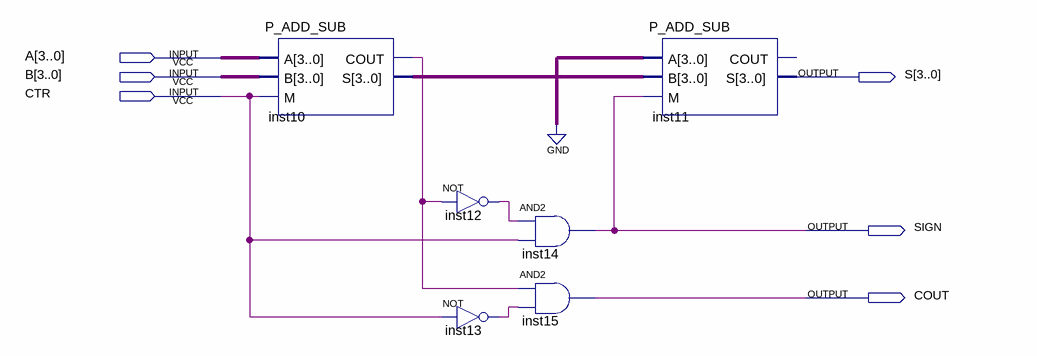
[diagram p0: schematic sheet]
// Quartus schematic ADD_SUB_4.bdf as structural Verilog: 6 symbols, 6 pins
module ADD_SUB_4 (
  input  [3:0] A,
  input  [3:0] B,
  input  CTR,
  output [3:0] S,
  output SIGN,
  output COUT
);

  wire inst10_cout, inst12_out, inst13_out;
  wire [3:0] inst10_s;

  P_ADD_SUB inst10 (.A(A), .B(B), .M(CTR), .COUT(inst10_cout), .S(inst10_s));
  not inst12 (inst12_out, inst10_cout);
  not inst13 (inst13_out, CTR);
  and inst14 (SIGN, inst12_out, CTR);
  and inst15 (COUT, inst10_cout, inst13_out);
  P_ADD_SUB inst11 (.A(4'b0000), .B(inst10_s), .M(SIGN), .S(S));  // open: COUT
endmodule
